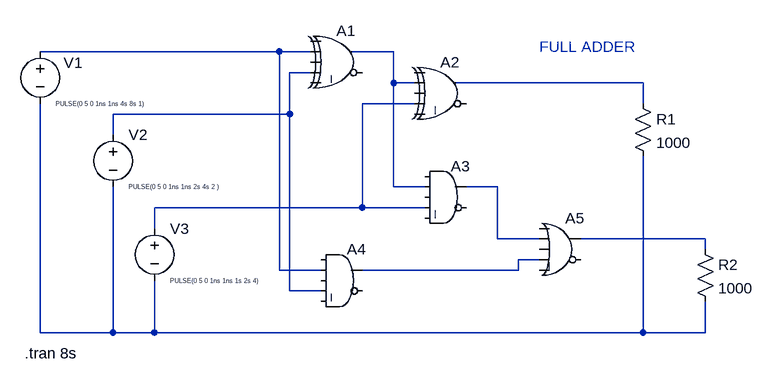
[diagram p0: schematic FULL_ADDER.asc]
FULL_ADDER.asc, the LTspice schematic file:
Version 4
SHEET 1 880 680
WIRE 80 80 -288 80
WIRE 128 80 80 80
WIRE 256 80 192 80
WIRE 128 112 96 112
WIRE 256 128 256 80
WIRE 288 128 256 128
WIRE 640 128 352 128
WIRE 288 160 208 160
WIRE 640 160 640 128
WIRE 96 176 96 112
WIRE 96 176 -176 176
WIRE -176 208 -176 176
WIRE 256 288 256 128
WIRE 304 288 256 288
WIRE 416 288 368 288
WIRE 208 320 208 160
WIRE 208 320 -112 320
WIRE 304 320 208 320
WIRE -112 352 -112 320
WIRE 416 368 416 288
WIRE 480 368 416 368
WIRE 736 368 544 368
WIRE 736 384 736 368
WIRE 480 400 448 400
WIRE 80 416 80 80
WIRE 144 416 80 416
WIRE 448 416 448 400
WIRE 448 416 208 416
WIRE 96 448 96 176
WIRE 144 448 96 448
WIRE -288 512 -288 160
WIRE -176 512 -176 288
WIRE -176 512 -288 512
WIRE -112 512 -112 432
WIRE -112 512 -176 512
WIRE 640 512 640 240
WIRE 640 512 -112 512
WIRE 736 512 736 464
WIRE 736 512 640 512
SYMBOL Digital\\xor 176 32 R0
SYMATTR InstName A1
SYMBOL Digital\\xor 336 80 R0
SYMATTR InstName A2
SYMBOL Digital\\and 336 240 R0
SYMATTR InstName A3
SYMBOL Digital\\and 176 368 R0
SYMATTR InstName A4
SYMBOL Digital\\or 512 320 R0
SYMATTR InstName A5
SYMBOL voltage -288 64 R0
WINDOW 3 24 96 Left 0
WINDOW 123 0 0 Left 0
WINDOW 39 0 0 Left 0
WINDOW 0 36 33 Left 2
SYMATTR Value PULSE(0 5 0 1ns 1ns 4s 8s 1)
SYMATTR InstName V1
SYMBOL voltage -176 192 R0
WINDOW 3 24 96 Left 0
WINDOW 123 0 0 Left 0
WINDOW 39 0 0 Left 0
SYMATTR Value PULSE(0 5 0 1ns 1ns 2s 4s 2 )
SYMATTR InstName V2
SYMBOL voltage -112 336 R0
WINDOW 3 24 96 Left 0
WINDOW 123 0 0 Left 0
WINDOW 39 0 0 Left 0
SYMATTR Value PULSE(0 5 0 1ns 1ns 1s 2s 4)
SYMATTR InstName V3
SYMBOL res 624 144 R0
SYMATTR InstName R1
SYMATTR Value 1000
SYMBOL res 720 368 R0
SYMATTR InstName R2
SYMATTR Value 1000
TEXT -312 544 Left 2 !.tran 8s
TEXT 480 72 Left 2 ;FULL ADDER

The netlist it stands for:
* FULL_ADDER.asc
A1 0 N001 0 N003 0 0 N002 0 XOR
A2 0 N002 0 N005 0 0 N004 0 XOR
A3 0 N002 0 N005 0 0 N006 0 AND
A4 0 N001 0 N003 0 0 N008 0 AND
A5 0 N006 0 N008 0 0 N007 0 OR
V1 N001 N009 PULSE(0 5 0 1ns 1ns 4s 8s 1)
V2 N003 N009 PULSE(0 5 0 1ns 1ns 2s 4s 2 )
V3 N005 N009 PULSE(0 5 0 1ns 1ns 1s 2s 4)
R1 N004 N009 1000
R2 N007 N009 1000
.tran 8s
* FULL ADDER
.backanno
.end